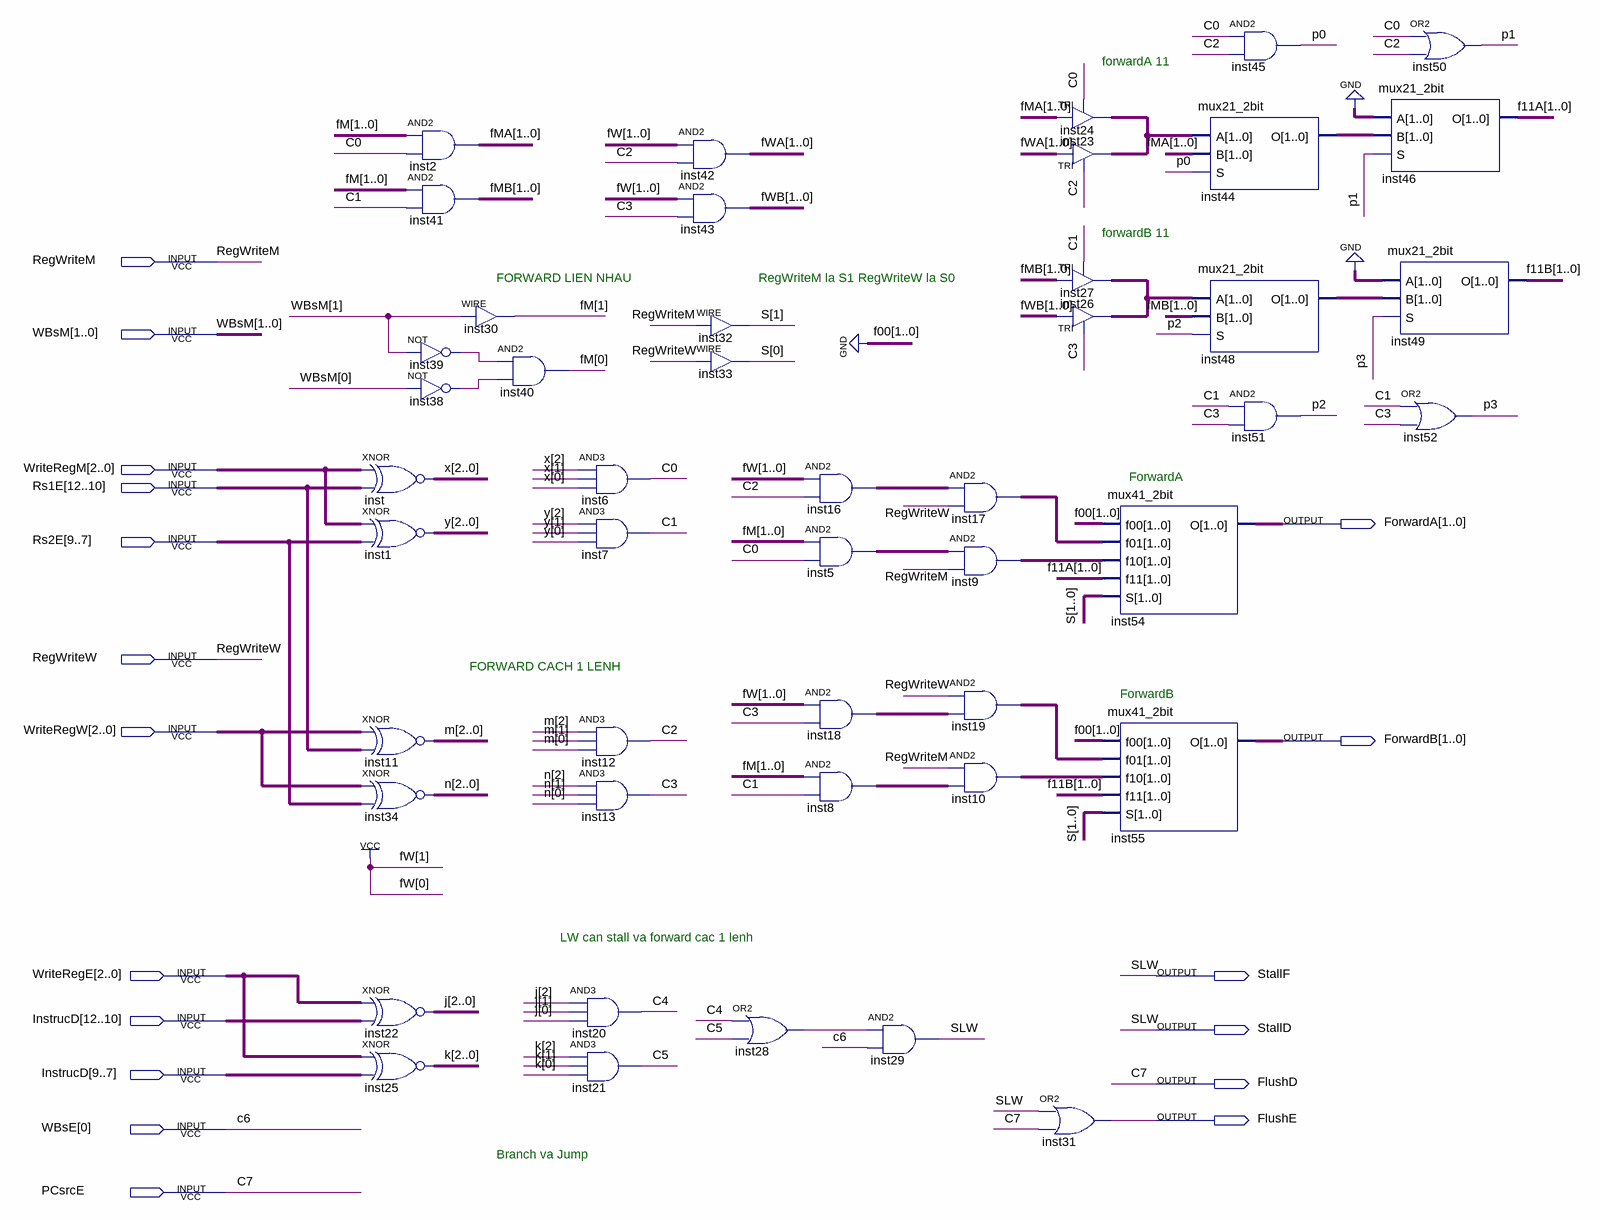
[diagram p0: schematic sheet]
// Quartus schematic Hazard_Unit.bdf as structural Verilog: 47 symbols, 18 pins
module Hazard_Unit (
  input  RegWriteM,
  input  [1:0] WBsM,
  input  [2:0] WriteRegM,
  input  [12:10] Rs1E,
  input  [9:7] Rs2E,
  input  RegWriteW,
  input  [2:0] WriteRegW,
  input  [2:0] WriteRegE,
  input  [12:7] InstrucD,
  input  [0:0] WBsE,
  input  PCsrcE,
  output [1:0] ForwardA,
  output [1:0] ForwardB,
  output StallF,
  output StallD,
  output FlushD,
  output FlushE
);

  wire C0, C1, C2, C3, C4, C5, inst28_out, inst38_out, inst39_out, p0, p1, p2, p3;
  wire [1:0] f11A, f11B, fM, fMA, fMB, fWA, fWB, inst5_out, inst8_out, inst9_out, inst10_out, inst16_out,
       inst17_out, inst18_out, inst19_out, inst24_out, inst27_out, inst44_o, inst48_o, S;
  wire [2:0] j, k, m, n, x, y;

  assign x = ~(WriteRegM ^ Rs1E);  // XNOR inst, 3 bits wide
  assign y = ~(WriteRegM ^ Rs2E);  // XNOR inst1, 3 bits wide
  assign m = ~(WriteRegW ^ Rs1E);  // XNOR inst11, 3 bits wide
  assign n = ~(WriteRegW ^ Rs2E);  // XNOR inst34, 3 bits wide
  assign j = ~(WriteRegE ^ InstrucD[12:10]);  // XNOR inst22, 3 bits wide
  assign k = ~(WriteRegE ^ InstrucD[9:7]);  // XNOR inst25, 3 bits wide
  assign fMA = fM & {2{C0}};  // AND2 inst2, 2 bits wide
  assign fMB = fM & {2{C1}};  // AND2 inst41, 2 bits wide
  assign fM[1] = WBsM[1];  // WIRE inst30
  not inst39 (inst39_out, WBsM[1]);
  not inst38 (inst38_out, WBsM[0]);
  and inst40 (fM[0], inst39_out, inst38_out);
  and inst6 (C0, x[2], x[1], x[0]);
  and inst7 (C1, y[2], y[1], y[0]);
  and inst12 (C2, m[2], m[1], m[0]);
  and inst13 (C3, n[2], n[1], n[0]);
  and inst20 (C4, j[2], j[1], j[0]);
  and inst21 (C5, k[2], k[1], k[0]);
  assign fWA = 2'b11 & {2{C2}};  // AND2 inst42, 2 bits wide
  assign fWB = 2'b11 & {2{C3}};  // AND2 inst43, 2 bits wide
  assign S[1] = RegWriteM;  // WIRE inst32
  assign S[0] = RegWriteW;  // WIRE inst33
  or inst28 (inst28_out, C4, C5);
  assign inst16_out = 2'b11 & {2{C2}};  // AND2 inst16, 2 bits wide
  assign inst5_out = fM & {2{C0}};  // AND2 inst5, 2 bits wide
  assign inst18_out = 2'b11 & {2{C3}};  // AND2 inst18, 2 bits wide
  assign inst8_out = fM & {2{C1}};  // AND2 inst8, 2 bits wide
  and inst29 (StallD, inst28_out, WBsE[0]);
  assign inst17_out = inst16_out & {2{RegWriteW}};  // AND2 inst17, 2 bits wide
  assign inst9_out = inst5_out & {2{RegWriteM}};  // AND2 inst9, 2 bits wide
  assign inst19_out = {2{RegWriteW}} & inst18_out;  // AND2 inst19, 2 bits wide
  assign inst10_out = {2{RegWriteM}} & inst8_out;  // AND2 inst10, 2 bits wide
  or inst31 (FlushE, StallD, PCsrcE);
  TRI inst24[1:0] (.IN(fMA), .OE(C0), .OUT(inst24_out));
  TRI inst23[1:0] (.IN(fWA), .OE(C2), .OUT(inst24_out));
  TRI inst27[1:0] (.IN(fMB), .OE(C1), .OUT(inst27_out));
  TRI inst26[1:0] (.IN(fWB), .OE(C3), .OUT(inst27_out));
  mux41_2bit inst54 (.f00(2'b00), .f01(inst17_out), .f10(inst9_out), .f11(f11A), .S(S), .O(ForwardA));
  mux41_2bit inst55 (.f00(2'b00), .f01(inst19_out), .f10(inst10_out), .f11(f11B), .S(S), .O(ForwardB));
  mux21_2bit inst44 (.A(inst24_out), .B(fMA), .S(p0), .O(inst44_o));
  mux21_2bit inst48 (.A(inst27_out), .B(fMB), .S(p2), .O(inst48_o));
  and inst45 (p0, C0, C2);
  and inst51 (p2, C1, C3);
  or inst50 (p1, C0, C2);
  mux21_2bit inst46 (.A(2'b00), .B(inst44_o), .S(p1), .O(f11A));
  mux21_2bit inst49 (.A(2'b00), .B(inst48_o), .S(p3), .O(f11B));
  or inst52 (p3, C1, C3);

  assign FlushD = PCsrcE;
  assign StallF = StallD;

  // Other names for the same wires on the sheet: c6 = WBsE[0]; C7 = PCsrcE; SLW = StallD

  // Notes on the sheet:
  //   forwardA 11
  //   forwardB 11
  //   FORWARD LIEN NHAU
  //   RegWriteM la S1
  //   RegWriteW la S0
  //   ForwardA
  //   FORWARD CACH 1 LENH
  //   ForwardB
  //   LW can stall va forward cac 1 lenh
  //   Branch va Jump
endmodule
